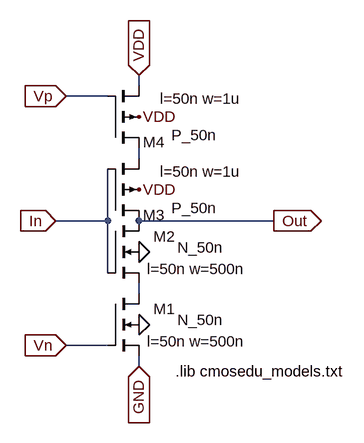
[diagram p0: schematic CS_inv.asc]
CS_inv.asc, the LTspice schematic file:
Version 4
SHEET 1 6288 680
WIRE 608 -480 544 -480
WIRE 608 -288 528 -288
WIRE 608 -288 608 -368
WIRE 608 -208 608 -288
WIRE 608 -96 544 -96
WIRE 656 -496 656 -512
WIRE 656 -384 656 -400
WIRE 656 -176 656 -192
WIRE 656 -64 656 -80
WIRE 864 -288 656 -288
FLAG 656 -128 0
FLAG 656 -448 VDD
FLAG 656 -336 VDD
FLAG 656 -240 0
FLAG 656 -512 VDD
IOPIN 656 -512 In
FLAG 528 -288 In
IOPIN 528 -288 In
FLAG 544 -480 Vp
IOPIN 544 -480 In
FLAG 544 -96 Vn
IOPIN 544 -96 In
FLAG 864 -288 Out
IOPIN 864 -288 Out
FLAG 656 -64 GND
IOPIN 656 -64 In
SYMBOL nmos4 608 -176 R0
WINDOW 0 104 24 Right 0
WINDOW 3 179 41 Right 0
WINDOW 123 213 74 Right 0
SYMATTR InstName M1
SYMATTR Value N_50n
SYMATTR Value2 l=50n w=500n
SYMBOL pmos4 608 -400 M180
WINDOW 0 88 9 Right 0
WINDOW 3 168 20 Right 0
WINDOW 123 206 76 Right 0
SYMATTR InstName M4
SYMATTR Value P_50n
SYMATTR Value2 l=50n w=1u
SYMBOL pmos4 608 -288 M180
WINDOW 0 88 9 Right 0
WINDOW 3 168 20 Right 0
WINDOW 123 206 76 Right 0
SYMATTR InstName M3
SYMATTR Value P_50n
SYMATTR Value2 l=50n w=1u
SYMBOL nmos4 608 -288 R0
WINDOW 0 104 24 Right 0
WINDOW 3 179 41 Right 0
WINDOW 123 213 74 Right 0
SYMATTR InstName M2
SYMATTR Value N_50n
SYMATTR Value2 l=50n w=500n
TEXT 712 -56 Left 0 !.lib cmosedu_models.txt

The netlist it stands for:
* CS_inv.asc
M1 N002 Vn GND 0 N_50n l=50n w=500n
M4 N001 Vp VDD VDD P_50n l=50n w=1u
M3 Out In N001 VDD P_50n l=50n w=1u
M2 Out In N002 0 N_50n l=50n w=500n
.model NMOS NMOS
.model PMOS PMOS
.lib standard.mos
.lib cmosedu_models.txt
.backanno
.end